# EAGLE design GiGaMega_nano (EAGLE 7.1.0)
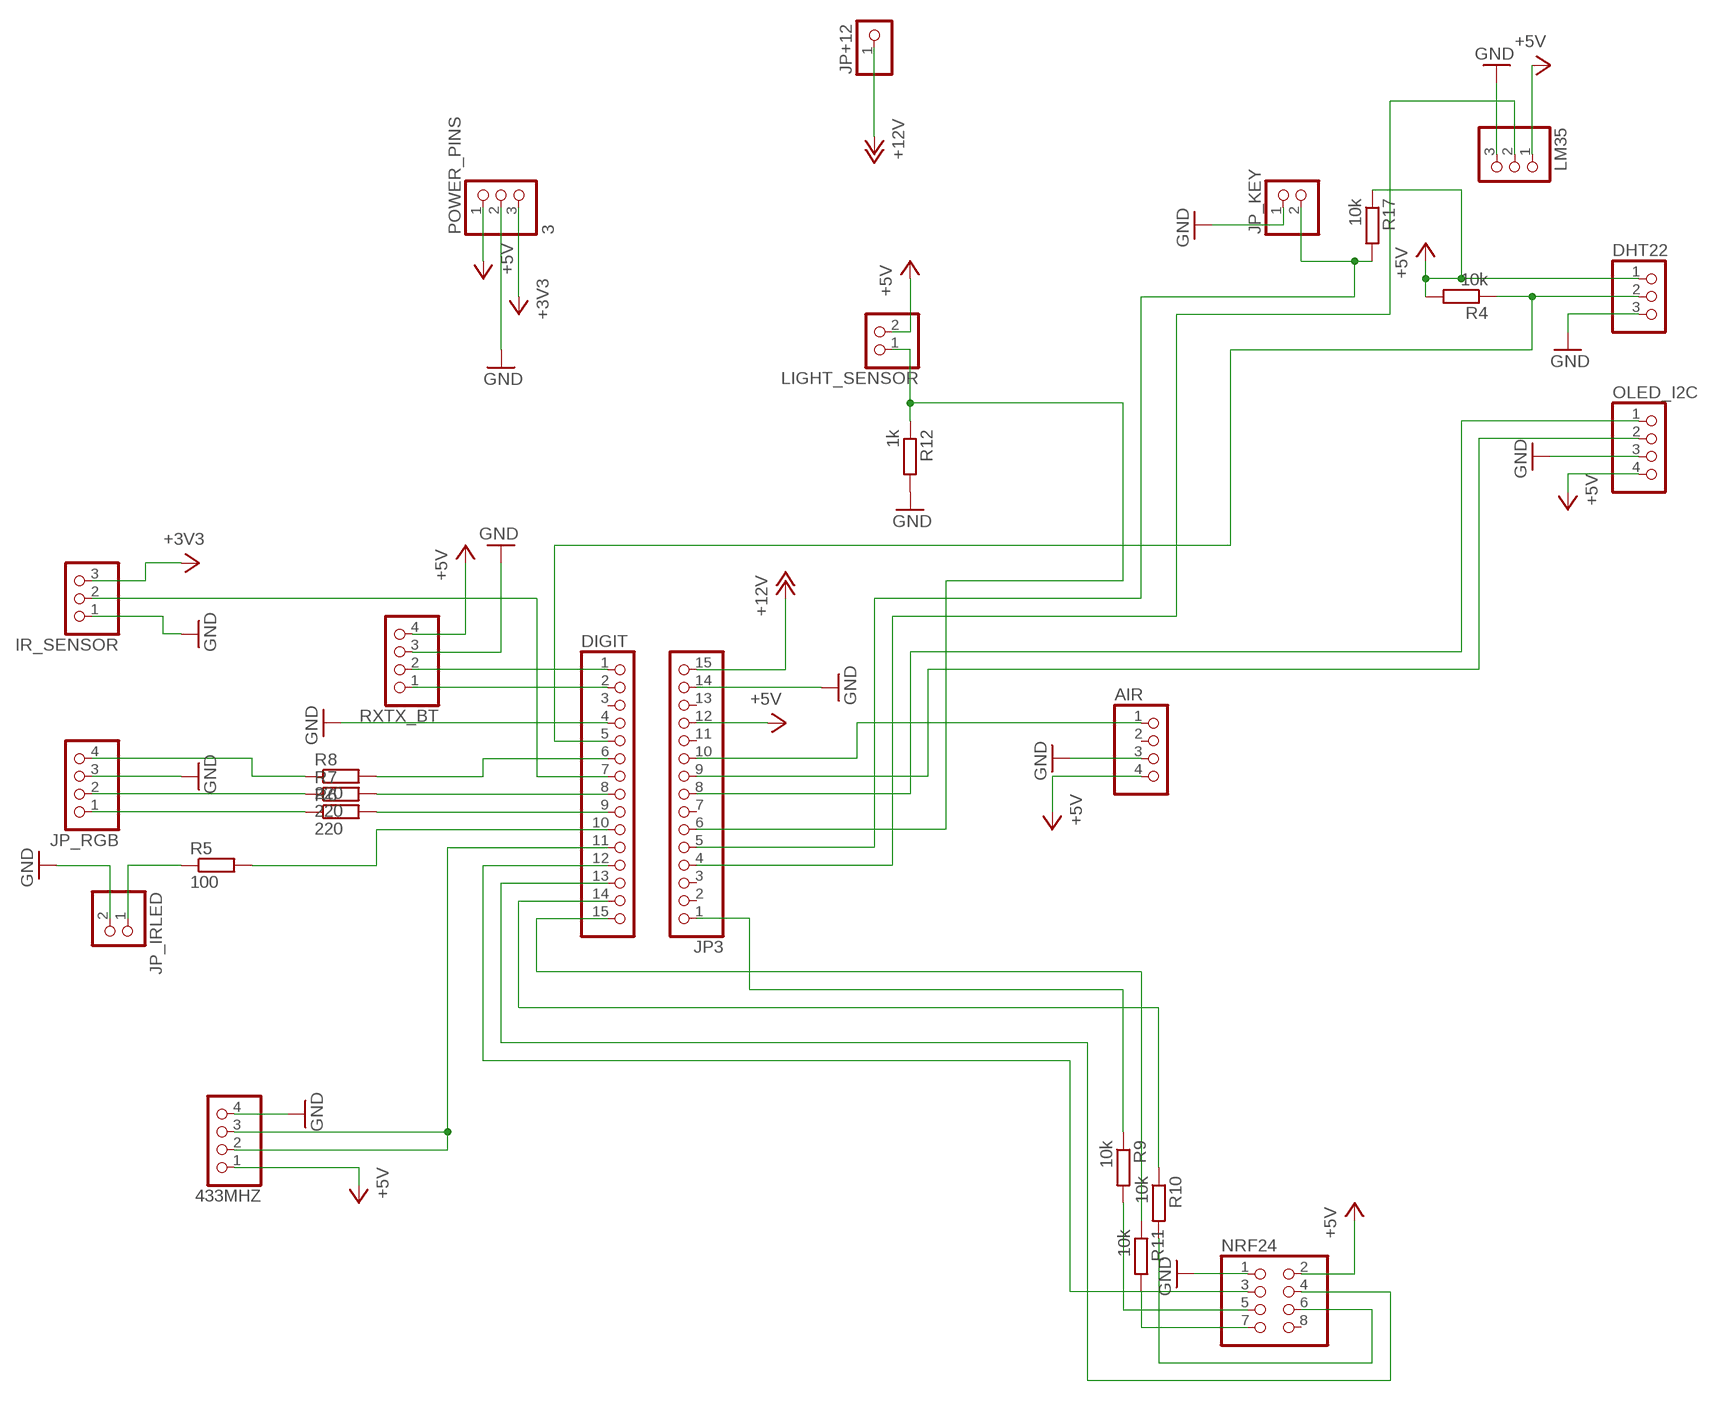
[diagram p0: schematic, sheet 1]

## Parts
433MHZ  PINHD-1X4  [1X04]
AIR  PINHD-1X4  [1X04]
DHT22  PINHD-1X3  [1X03]
DIGIT  PINHD-1X15  [1X15]
IR_SENSOR  PINHD-1X3  [1X03]
JP3  PINHD-1X15  [1X15]
JP+12  PINHD-1X1  [1X01]
JP_IRLED  PINHD-1X2  [1X02]
JP_KEY  PINHD-1X2  [1X02]
JP_RGB  PINHD-1X4  [1X04]
LIGHT_SENSOR  PINHD-1X2  [1X02]
LM35  PINHD-1X3  [1X03]
NRF24  PINHD-2X4  [2X04]
OLED_I2C  PINHD-1X4  [1X04]
POWER_PINS  3  PINHD-1X3  [1X03]
R4  10k  R-EU_R1206  [R1206]
R5  100  R-EU_R1206  [R1206]
R6  220  R-EU_R1206  [R1206]
R7  220  R-EU_R1206  [R1206]
R8  220  R-EU_R1206  [R1206]
R9  10k  R-EU_R1206  [R1206]
R10  10k  R-EU_R1206  [R1206]
R11  10k  R-EU_R1206  [R1206]
R12  1k  R-EU_R1206  [R1206]
R17  10k  R-EU_R1206  [R1206]
RXTX_BT  PINHD-1X4  [1X04]

## Nets
+3V3: IR_SENSOR.3 POWER_PINS.3
+5V: 433MHZ.1 AIR.4 DHT22.1 JP3.12 LIGHT_SENSOR.2 LM35.1 NRF24.2 OLED_I2C.4 POWER_PINS.1 R4.2 R17.1 RXTX_BT.4
+12V: JP3.15 JP+12.1
BLUE: JP_RGB.1 R6.1
BLUE_6: DIGIT.9 R6.2
CE: DIGIT.12 NRF24.3
CSN: DIGIT.13 NRF24.4
GND: 433MHZ.4 AIR.3 DHT22.3 DIGIT.4 IR_SENSOR.1 JP3.14 JP_IRLED.2 JP_KEY.1 JP_RGB.3 LM35.3 NRF24.1 OLED_I2C.3 POWER_PINS.2 R12.2 RXTX_BT.3
GREEN: JP_RGB.2 R7.1
GREEN_5: DIGIT.8 R7.2
KEY_PIN: JP3.5 JP_KEY.2 R17.2
MISO: DIGIT.15 R11.1
MOSI: DIGIT.14 R10.1
N$1: JP3.1 R9.1
N$2: JP_IRLED.1 R5.1
N$3: 433MHZ.2 433MHZ.3 DIGIT.11
N$4: AIR.1 JP3.10
N$5: DIGIT.7 IR_SENSOR.2
N$6: DIGIT.10 R5.2
N$24: NRF24.6 R10.2
N$25: NRF24.7 R11.2
N$30: NRF24.5 R9.2
PIN13: DHT22.2 DIGIT.5 R4.1
PIN23: JP3.6 LIGHT_SENSOR.1 R12.1
PIN25: JP3.4 LM35.2
RED: JP_RGB.4 R8.1
RED_3: DIGIT.6 R8.2
RX: DIGIT.2 RXTX_BT.1
SCL: JP3.9 OLED_I2C.2
SDA: JP3.8 OLED_I2C.1
TX: DIGIT.1 RXTX_BT.2
Unconnected: AIR.2 DIGIT.3 JP3.2 JP3.3 JP3.7 JP3.11 JP3.13 NRF24.8

## Library data of the parts
433MHZ AIR JP_RGB OLED_I2C RXTX_BT = pinhead:PINHD-1X4: PIN HEADER
DHT22 IR_SENSOR LM35 POWER_PINS = pinhead:PINHD-1X3: PIN HEADER
DIGIT JP3 = pinhead:PINHD-1X15: PIN HEADER
JP+12 = pinhead:PINHD-1X1: PIN HEADER
JP_IRLED JP_KEY LIGHT_SENSOR = pinhead:PINHD-1X2: PIN HEADER
NRF24 = pinhead:PINHD-2X4: PIN HEADER
R4-R12 R17 = rcl:R-EU_: RESISTOR, European symbol

## Board
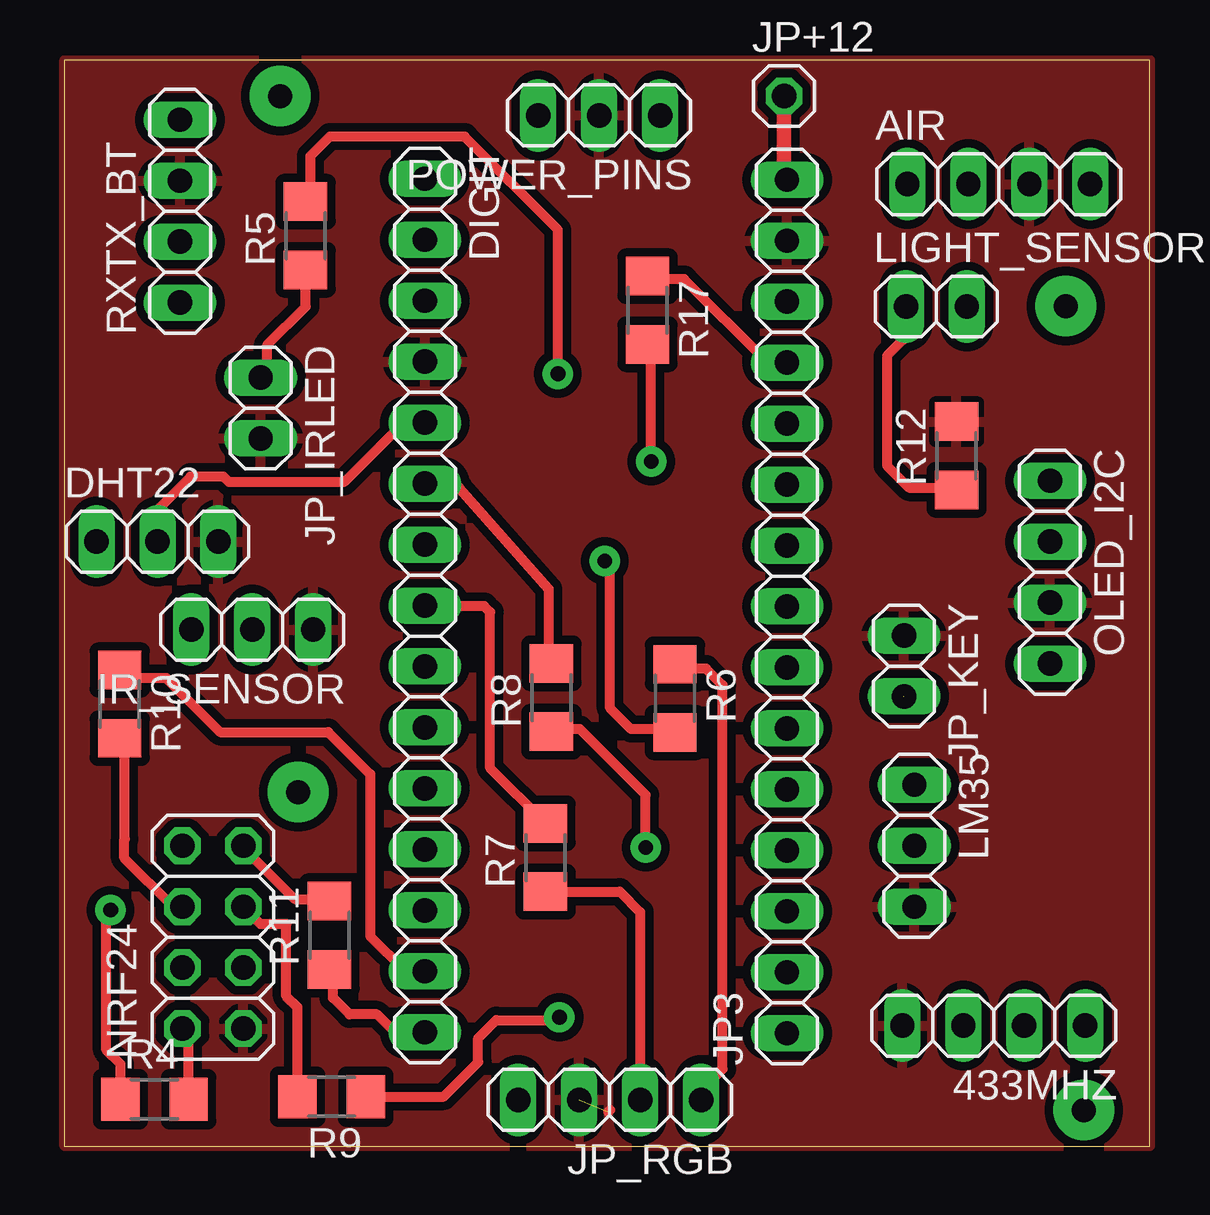
[diagram p1: board, top side]
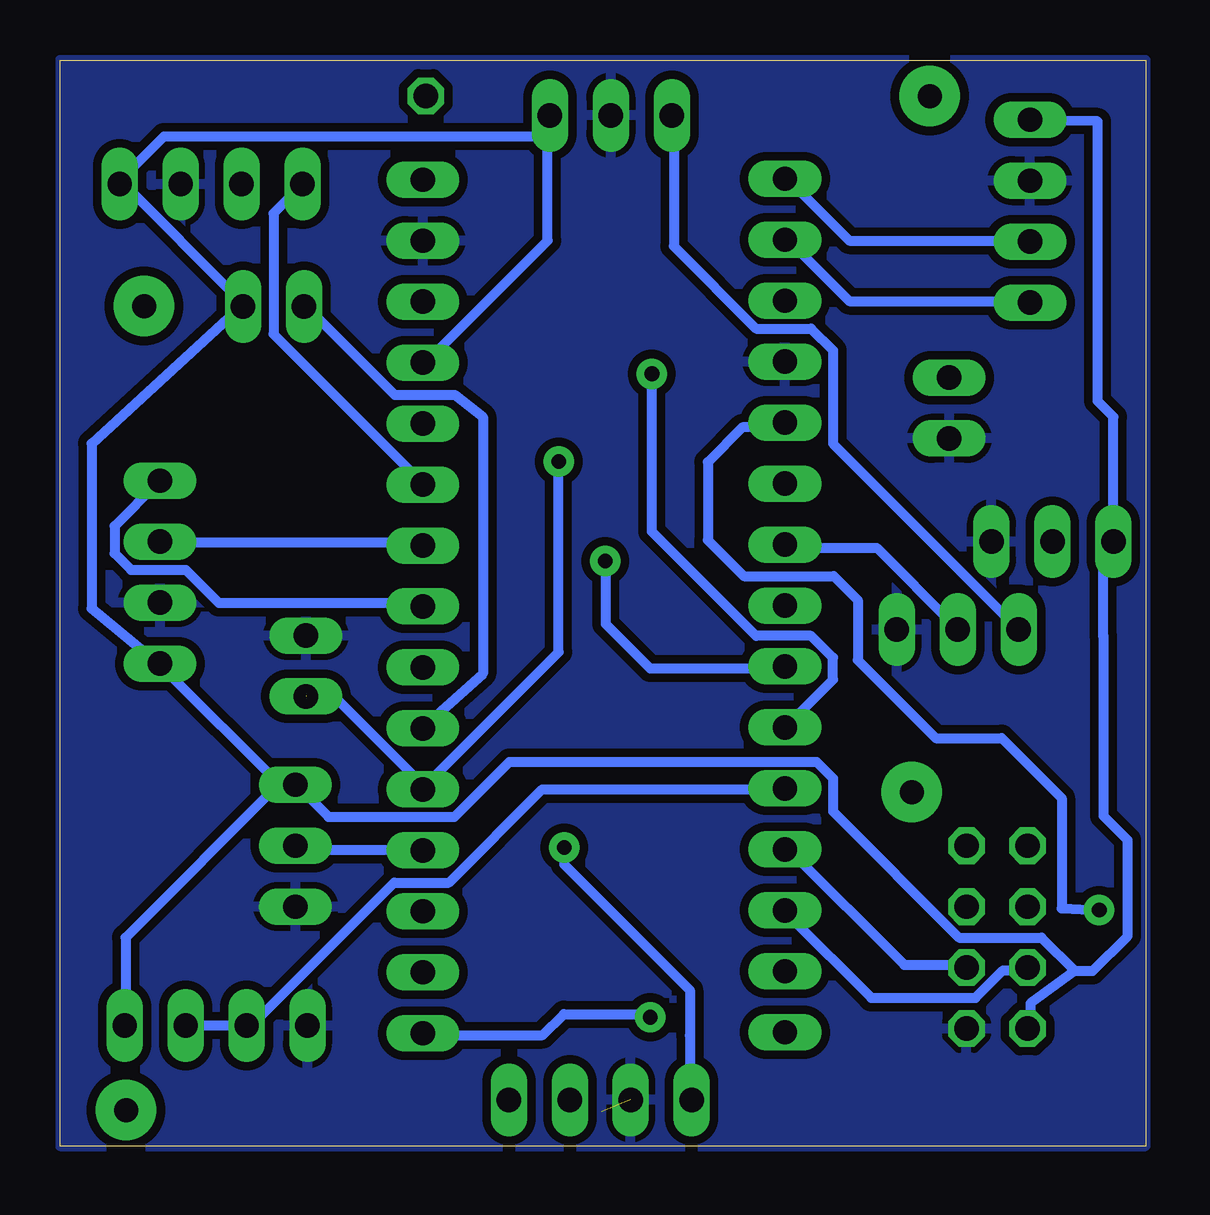
[diagram p2: board, bottom side, seen from below]

Size 45.25 x 45.25 mm. Coordinates in mm from the lower left corner, seen from the top.
Outline: 0,0 45.25,0 45.25,45.25 0,45.25 0,0
Copper layers (1*16): Top 0.035mm / dielectric 1mm / Bottom 0.035mm
Design rules "default *": minimum track width 10mil, minimum drill 24mil, track to track 14mil, track to pad 14mil, pad to pad 8mil, via to via 8mil, smd to smd 8mil, copper to edge 0mil, drill to drill 8mil, minimum pad ring 10mil, minimum via ring 8mil, stop-mask expansion 4mil, vias tented up to drill 0mil, thermal gap 10mil

### Footprints (pad centres in the part's own frame; a part is rotated, then mirrored left to right if it is on the bottom)
1X04 = drill 1.016 long: 1 -3.81,0; 2 -1.27,0; 3 1.27,0; 4 3.81,0
1X03 = drill 1.016 long: 1 -2.54,0; 2 0,0; 3 2.54,0
1X15 = drill 1.016 long: 1 -17.78,0; 2 -15.24,0; 3 -12.7,0; 4 -10.16,0; 5 -7.62,0; 6 -5.08,0; 7 -2.54,0; 8 0,0; 9 2.54,0; 10 5.08,0; 11 7.62,0; 12 10.16,0; 13 12.7,0; 14 15.24,0; 15 17.78,0
1X01 = drill 1.016 octagon: 1 0,0
1X02 = drill 1.016 long: 1 -1.27,0; 2 1.27,0
2X04 = drill 1.016 octagon: 1 -3.81,-1.27; 2 -3.81,1.27; 3 -1.27,-1.27; 4 -1.27,1.27; 5 1.27,-1.27; 6 1.27,1.27; 7 3.81,-1.27; 8 3.81,1.27
R1206 = smd 1.6 x 1.803: 1 -1.422,0; 2 1.422,0

### Placement (x,y rotation side)
433MHZ  38.74,5.02 180 top
AIR  38.95,40.08 0 top
DHT22  3.88,25.18 0 top
DIGIT  15.03,22.52 270 top
IR_SENSOR  7.83,21.52 180 top
JP3  30.12,22.48 90 top
JP+12  30,43.75 0 top
JP_IRLED  8.18,30.75 270 top
JP_KEY  35,20 270 top
JP_RGB  22.73,1.92 180 top
LIGHT_SENSOR  36.35,34.98 0 top
LM35  35.43,12.51 270 top
NRF24  6.19,8.7 90 top
OLED_I2C  41.08,23.91 270 top
POWER_PINS  22.29,42.94 180 top
R4  3.76,1.95 0 top
R5  10.05,37.93 90 top
R6  25.45,18.65 270 top
R7  20.05,12.02 90 top
R8  20.3,18.69 90 top
R9  11.14,2.05 180 top
R10  2.31,18.41 270 top
R11  11.05,8.78 90 top
R12  37.19,28.76 90 top
R17  24.31,34.82 270 top
RXTX_BT  4.82,38.95 90 top

### Tracks (layer width: path | path; a pad name or v marks a point on that pad's centre or on a via)
+3V3
  Bottom 0.254: 5.49,21.72 IR_SENSOR.3 | 19.66,42.75 POWER_PINS.3
  Bottom 0.406: 5.49,21.72 13.03,29.26 13.03,33.15 13.95,34.06 16.23,34.06 19.66,37.49 19.66,42.75
+5V
  Top 0.254: 24.46,36.12 R17.1 | 29.95,32.69 JP3.12
  Top 0.406: 24.46,36.12 25.83,36.12 29.26,32.69 29.95,32.69 | R4.2 5.18,4.63 NRF24.2
  Bottom 0.254: 4.8,42.75 RXTX_BT.4 | 4.8,5.03 NRF24.2 | 35.43,15.09 LM35.1 | 40.92,19.89 OLED_I2C.4 41.15,20.12 | 42.52,5.03 433MHZ.1 | 36.12,15.09 LM35.1 | 37.72,35.2 LIGHT_SENSOR.2 37.72,34.98 | 24.92,42.75 POWER_PINS.1 24.92,42.06 | 29.95,32.69 JP3.12 | 42.75,40.23 AIR.4 | 35.2,14.86 LM35.1
  Bottom 0.406: 4.8,42.75 1.99,42.69 1.99,31.03 1.34,30.38 DHT22.1 1.76,24.75 1.76,21.26 1.75,21.25 1.75,13.75 0.75,12.75 0.75,8.75 2.2,7.3 2.95,7.3 2.95,7.29 | 4.8,5.03 4.8,5.94 2.95,7.29 | 36.12,15.09 35.43,15.09 | 40.92,19.89 36.12,15.09 | 42.52,5.03 42.52,8.69 36.12,15.09 | 37.72,35.2 42.75,40.23 40.92,42.06 24.92,42.06 | 24.92,42.06 24.92,37.72 29.95,32.69 | 24.92,42.06 24.92,42.75 | 41.15,20.12 43.93,22.4 43.93,29.26 37.72,34.98 | 2.95,7.29 4.34,8.69 7.77,8.69 13.03,13.95 13.03,15.32 13.72,16 26.52,16 28.8,13.72 34.06,13.72 35.2,14.86
+12V
  Top 0.61: JP+12.1 30,40.38 JP3.15
BLUE
  Top 0.254: 25.6,19.89 R6.1
  Top 0.406: 25.6,19.89 26.75,19.89 27.43,19.2 27.43,3.2 26.75,2.52 26.75,1.71 | 26.75,1.6 26.75,1.71 | 26.75,1.71 JP_RGB.1
BLUE_6  (via drill 0.61 pad 1.27)
  Top 0.254: 25.38,17.37 R6.2
  Top 0.406: 25.22,17 R6.2 | 25.38,17.37 23.63,17.37 22.75,18.25 22.75,24.15 v22.52,24.37
  Bottom 0.254: 15.09,19.89 DIGIT.9
  Bottom 0.406: 15.09,19.89 20.64,19.89 22.5,21.75 22.5,24.35 v22.52,24.37
CE
  Bottom 0.254: 7.54,7.54 NRF24.3 | 14.86,12.34 DIGIT.12
  Bottom 0.406: 7.54,7.54 10.06,7.54 14.86,12.34
CSN
  Bottom 0.254: 5.03,7.32 NRF24.4 | 14.86,9.6 DIGIT.13
  Bottom 0.406: 5.03,7.32 5.94,7.32 7.09,6.17 11.43,6.17 14.86,9.6
GND  (1 unrouted)
  Top 0.406: 22.67,1.42 22.75,1.5
  pour Top: 0,45.25 45.25,45.25 45.25,0 0,0
  pour Bottom: 0,45.25 45.25,45.25 45.25,0 0,0
GREEN
  Top 0.406: R7.1 23.15,10.6 24,9.75 JP_RGB.2
GREEN_5
  Top 0.406: R7.2 17.75,15.75 17.75,22.25 17.5,22.5 15.05,22.5 DIGIT.8
KEY_PIN  (via drill 0.61 pad 1.27)  (1 unrouted)
  Top 0.254: 24.46,33.38 R17.2
  Top 0.406: v24.46,28.52 24.46,33.38
  Bottom 0.254: 29.95,15.09 JP3.5 30.18,15.09
  Bottom 0.406: v24.46,28.52 24.46,20.57 29.95,15.09 | 34.98,18.75 33.83,18.75 30.18,15.09
MISO
  Top 0.254: 11.2,7.32 R11.1 | 14.86,4.8 DIGIT.15
  Top 0.406: 11.2,7.32 11.2,6.17 11.89,5.49 13.03,5.49 13.72,4.8 14.86,4.8
MOSI
  Top 0.406: DIGIT.14 14.22,7.28 12.75,8.75 12.75,15.5 11,17.25 6.5,17.25 4.25,19.5 2.64,19.5 R10.1
N$1  (via drill 0.61 pad 1.27)
  Top 0.254: 12.57,2.06 R9.1
  Top 0.406: 12.57,2.06 15.81,2.06 17.25,3.5 17.25,4.5 18,5.25 20.52,5.25 v20.64,5.37
  Bottom 0.254: 29.95,4.57 JP3.1
  Bottom 0.406: 29.95,4.57 29.24,4.62 25.14,4.62 24.25,5.5 20.77,5.5 v20.64,5.37
N$2
  Top 0.254: 10.06,36.35 R5.1
  Top 0.406: 10.06,36.35 10.06,34.98 8.46,33.38 8.46,32.46 8.23,32.23 JP_IRLED.1
N$3
  Bottom 0.254: 37.49,5.03 433MHZ.3 37.26,5.03 | 433MHZ.2 | 15.09,14.86 DIGIT.11
  Bottom 0.406: 433MHZ.2 37.49,5.03 | 15.09,14.86 25.15,14.86 29.03,10.97 31.32,10.97 37.26,5.03
N$4
  Bottom 0.254: 30.18,27.66 JP3.10 | 35.2,40.01 AIR.1
  Bottom 0.406: 30.18,27.66 36.35,33.83 36.35,38.86 35.2,40.01
N$5
  Bottom 0.254: 8,21.72 IR_SENSOR.2 | 14.86,24.92 DIGIT.7
  Bottom 0.406: 8,21.72 11.2,24.92 14.86,24.92
N$6  (via drill 0.61 pad 1.27)
  Top 0.254: 10.06,39.55 R5.2
  Top 0.406: v20.57,32.18 20.57,38.18 16.69,42.06 11.06,42.06 10.25,41.25 10.25,39.55 R5.2
  Bottom 0.406: v20.57,32.18 20.57,25.6 16.23,21.26 13.95,21.26 13.03,20.34 13.03,19.43 14.86,17.6 DIGIT.10
N$7  (via drill 1 pad 2.54)
  other vias: 9.75,14.75
N$8  (via drill 1 pad 2.54)
  other vias: 42.5,1.5
N$9  (via drill 1 pad 2.54)
  other vias: 41.75,35
N$10  (via drill 1 pad 2.54)
  other vias: 9,43.75
N$24
  Top 0.254: 2.52,16.92 R10.2
  Top 0.406: 2.52,16.92 2.52,12.8 2.5,12.79 2.5,12 4.53,9.97 NRF24.6
N$25
  Top 0.254: 10.97,10.29 R11.2 | 7.54,12.34 NRF24.7
  Top 0.406: 10.97,10.29 9.6,10.29 7.54,12.34
N$30
  Top 0.406: R9.2 9.72,5.78 9.25,6.25 9.25,9.25 8.18,9.25 NRF24.5
PIN13  (via drill 0.61 pad 1.27)
  Top 0.254: 3.89,25.38 DHT22.2
  Top 0.406: 3.89,25.38 3.89,26.52 5.26,27.89 6.63,27.89 6.86,27.66 11.66,27.66 13.95,29.95 14.86,29.95 DIGIT.5 | R4.1 2.34,3.41 1.75,4 1.75,9.65 v1.93,9.83
  Bottom 0.254: 15.09,29.95 DIGIT.5
  Bottom 0.406: 15.09,29.95 16.8,29.95 18.25,28.5 18.25,25.25 16.75,23.75 13,23.75 12,22.75 12,20.25 8.75,17 6,17 3.5,14.5 3.5,9.9 v1.93,9.83
PIN23
  Top 0.254: 36.35,27.43 R12.1 | 34.98,34.98 LIGHT_SENSOR.1
  Top 0.406: 36.35,27.43 35.2,27.43 34.29,28.35 34.29,32.92 34.98,33.6 34.98,34.98
  Bottom 0.254: 29.95,17.6 JP3.6 | 34.98,34.98 LIGHT_SENSOR.1
  Bottom 0.406: 29.95,17.6 27.62,19.68 27.62,30.38 28.78,31.3 31.3,31.3 34.98,34.98
PIN25
  Bottom 0.254: 30.18,12.34 JP3.4 | 35.2,12.34 LM35.2
  Bottom 0.406: 35.2,12.34 30.18,12.34
RED  (via drill 0.61 pad 1.27)
  Top 0.254: 20.43,17.37 R8.1
  Top 0.406: 20.43,17.37 21.49,17.37 24.23,14.63 v24.23,12.45
  Bottom 0.254: 18.97,1.6 JP_RGB.4
  Bottom 0.406: 18.97,1.6 18.97,4.57 19,4.6 19,6.5 24.23,11.73 v24.23,12.45
RED_3
  Top 0.254: 20.18,20.12 R8.2
  Top 0.406: 20.18,20.12 20.18,23.21 16.46,27.43 15.09,27.43 DIGIT.6
RX
  Bottom 0.254: 5.03,35.2 RXTX_BT.1 | 14.86,37.72 DIGIT.2
  Bottom 0.406: 5.03,35.2 12.34,35.2 14.86,37.72
SCL
  Bottom 0.254: 30.18,25.15 JP3.9 | 40.92,25.15 OLED_I2C.2
  Bottom 0.406: 40.92,25.15 30.18,25.15
SDA
  Bottom 0.254: 30.18,22.63 JP3.8 | 41.15,27.66 OLED_I2C.1
  Bottom 0.406: 30.18,22.63 38.63,22.63 40.01,24 42.29,24 42.98,24.69 42.98,25.83 41.15,27.66
TX
  Bottom 0.254: 5.03,37.72 RXTX_BT.2 | 14.86,40.23 DIGIT.1
  Bottom 0.406: 5.03,37.72 12.34,37.72 14.86,40.23